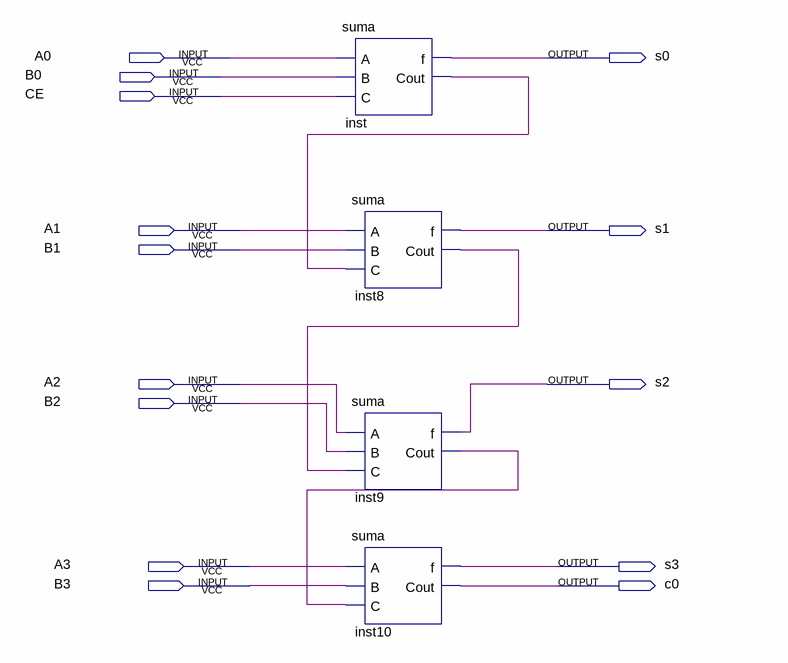
[diagram p0: schematic sheet]
// Quartus schematic Sumador.bdf as structural Verilog: 4 symbols, 14 pins
module Sumador (
  input  A0,
  input  B0,
  input  CE,
  input  A1,
  input  B1,
  input  A2,
  input  B2,
  input  A3,
  input  B3,
  output s0,
  output s1,
  output s2,
  output s3,
  output c0
);

  wire inst8_cout, inst9_cout, inst_cout;

  suma inst (.A(A0), .B(B0), .C(CE), .f(s0), .Cout(inst_cout));
  suma inst8 (.A(A1), .B(B1), .C(inst_cout), .f(s1), .Cout(inst8_cout));
  suma inst9 (.A(A2), .B(B2), .C(inst8_cout), .f(s2), .Cout(inst9_cout));
  suma inst10 (.A(A3), .B(B3), .C(inst9_cout), .f(s3), .Cout(c0));
endmodule
